# Altium schematic sheet Tennis Butler V1.0.SchDoc: Tennis Butler Top Level
size 228 x 165 mm; DrawnBy: Joseph Riesen; DocumentNumber: 1; Revision: 1.0; SheetNumber: 1; SheetTotal: 10
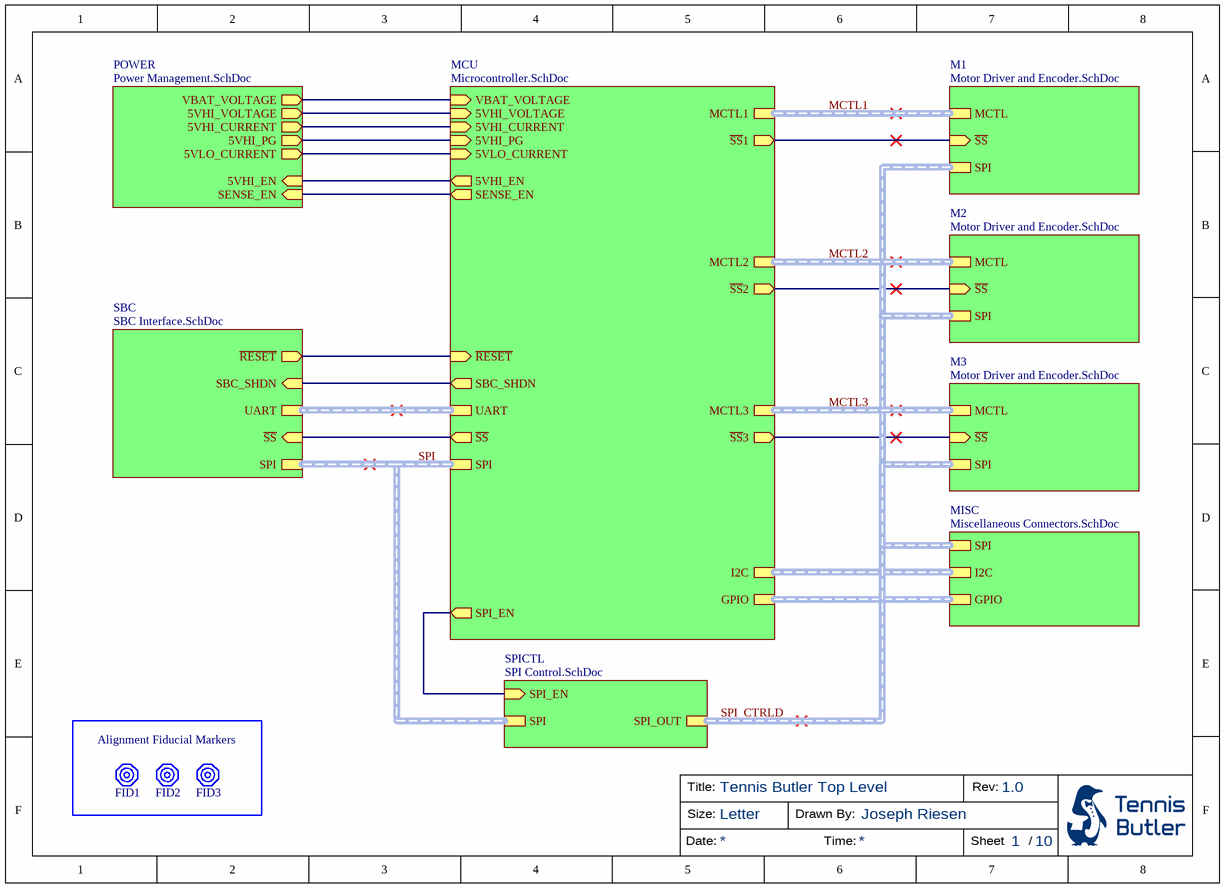
[diagram p0: Tennis Butler V1.0.SchDoc]

## Parts
FID1  Fiducial, Global  [Fiducial, Global]  (value not drawn)  (no BOM)
FID2  Fiducial, Global  [Fiducial, Global]  (value not drawn)  (no BOM)
FID3  Fiducial, Global  [Fiducial, Global]  (value not drawn)  (no BOM)

## Blocks framed on the sheet
Alignment Fiducial Markers: FID1-FID3

## Sub-sheets
M1 = Motor Driver and Encoder.SchDoc: ~{SS} (in), SPI (harness SPI), MCTL (harness Motor Control)
M2 = Motor Driver and Encoder.SchDoc: ~{SS} (in), SPI (harness SPI), MCTL (harness Motor Control)
M3 = Motor Driver and Encoder.SchDoc: ~{SS} (in), SPI (harness SPI), MCTL (harness Motor Control)
MCU = Microcontroller.SchDoc: SPI (harness SPI), UART (harness UART), ~{RESET} (in), MCTL3 (harness Motor Control), MCTL2 (harness Motor Control), MCTL1 (harness Motor Control), ~{SS}3 (out), ~{SS}2 (out), ~{SS}1 (out), VBAT_VOLTAGE (in), 5VLO_CURRENT (in), 5VHI_CURRENT (in), SENSE_EN (out), 5VHI_EN (out), 5VHI_PG (in), I2C (harness I2C), SBC_SHDN (out), GPIO (harness GPIO), ~{SS} (out), SPI_EN (out), 5VHI_VOLTAGE (in)
MISC = Miscellaneous Connectors.SchDoc: SPI (harness SPI), I2C (harness I2C), GPIO (harness GPIO)
POWER = Power Management.SchDoc: 5VHI_EN (in), SENSE_EN (in), VBAT_VOLTAGE (out), 5VHI_PG (out), 5VLO_CURRENT (out), 5VHI_CURRENT (out), 5VHI_VOLTAGE (out)
SBC = SBC Interface.SchDoc: UART (harness UART), ~{RESET} (out), ~{SS} (in), SPI (harness SPI), SBC_SHDN (in)
SPICTL = SPI Control.SchDoc: SPI_EN (in), SPI_OUT (harness SPI), SPI (harness SPI)

## Nets
(unnamed): sheet M1/~{SS}, sheet MCU/~{SS}1
(unnamed): sheet POWER/5VHI_EN, sheet MCU/5VHI_EN
(unnamed): sheet POWER/SENSE_EN, sheet MCU/SENSE_EN
(unnamed): sheet POWER/VBAT_VOLTAGE, sheet MCU/VBAT_VOLTAGE
(unnamed): sheet POWER/5VHI_PG, sheet MCU/5VHI_PG
(unnamed): sheet POWER/5VLO_CURRENT, sheet MCU/5VLO_CURRENT
(unnamed): sheet POWER/5VHI_CURRENT, sheet MCU/5VHI_CURRENT
(unnamed): sheet POWER/5VHI_VOLTAGE, sheet MCU/5VHI_VOLTAGE
(unnamed): sheet MCU/~{RESET}, sheet SBC/~{RESET}
(unnamed): sheet MCU/~{SS}3, sheet M3/~{SS}
(unnamed): sheet MCU/~{SS}2, sheet M2/~{SS}
(unnamed): sheet MCU/SBC_SHDN, sheet SBC/SBC_SHDN
(unnamed): sheet MCU/~{SS}, sheet SBC/~{SS}
(unnamed): sheet MCU/SPI_EN, sheet SPICTL/SPI_EN

## Buses and harness runs
harness MCTL1 = sheet M1/MCTL = sheet MCU/MCTL1
harness MCTL2 = sheet M2/MCTL = sheet MCU/MCTL2
harness MCTL3 = sheet M3/MCTL = sheet MCU/MCTL3
harness sheet MCU/GPIO = sheet MISC/GPIO
harness sheet MCU/I2C = sheet MISC/I2C
harness sheet MCU/UART = sheet SBC/UART
harness SPI = sheet MCU/SPI = sheet SBC/SPI = sheet SPICTL/SPI
harness SPI_CTRLD = sheet M1/SPI = sheet M2/SPI = sheet M3/SPI = sheet MISC/SPI = sheet SPICTL/SPI_OUT

## Notes on the sheet
- Title:
- Size:
- Letter
- Drawn By:
- Rev:
- Date:
- Time:
- Sheet
- /